# EAGLE design PwrGenBrd_v3 (EAGLE 7.6.0)
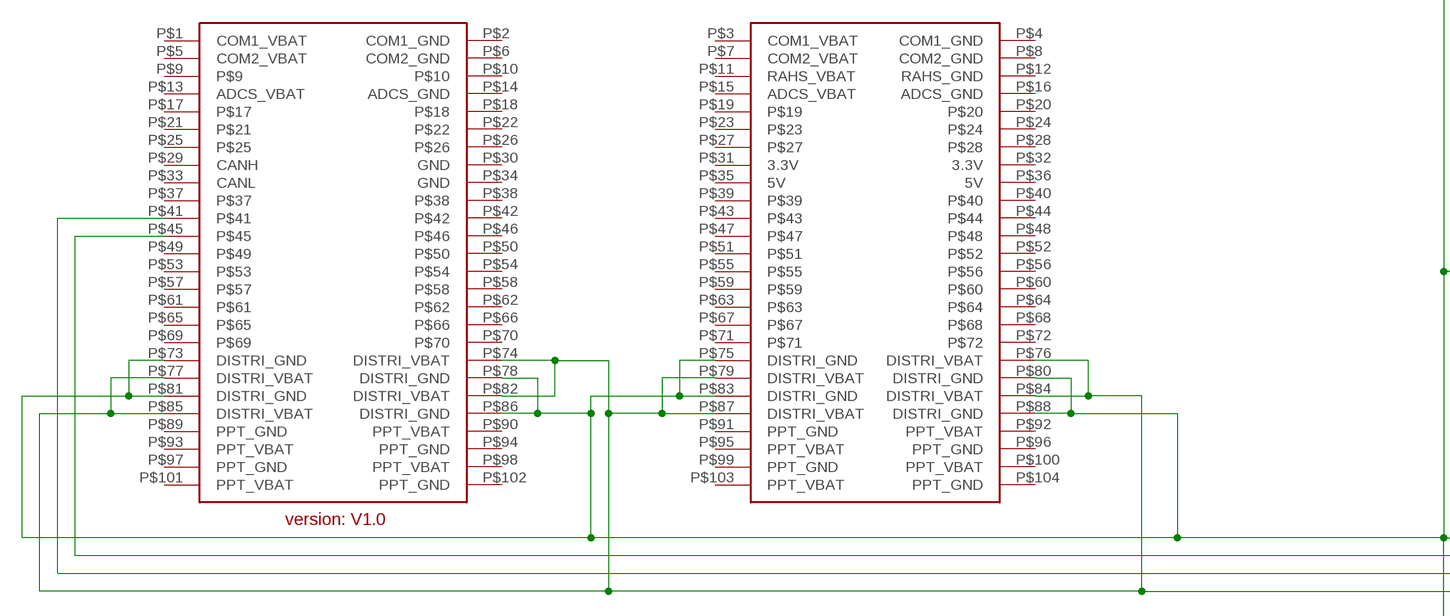
[diagram p0: schematic, sheet 1, part 1 of 2]
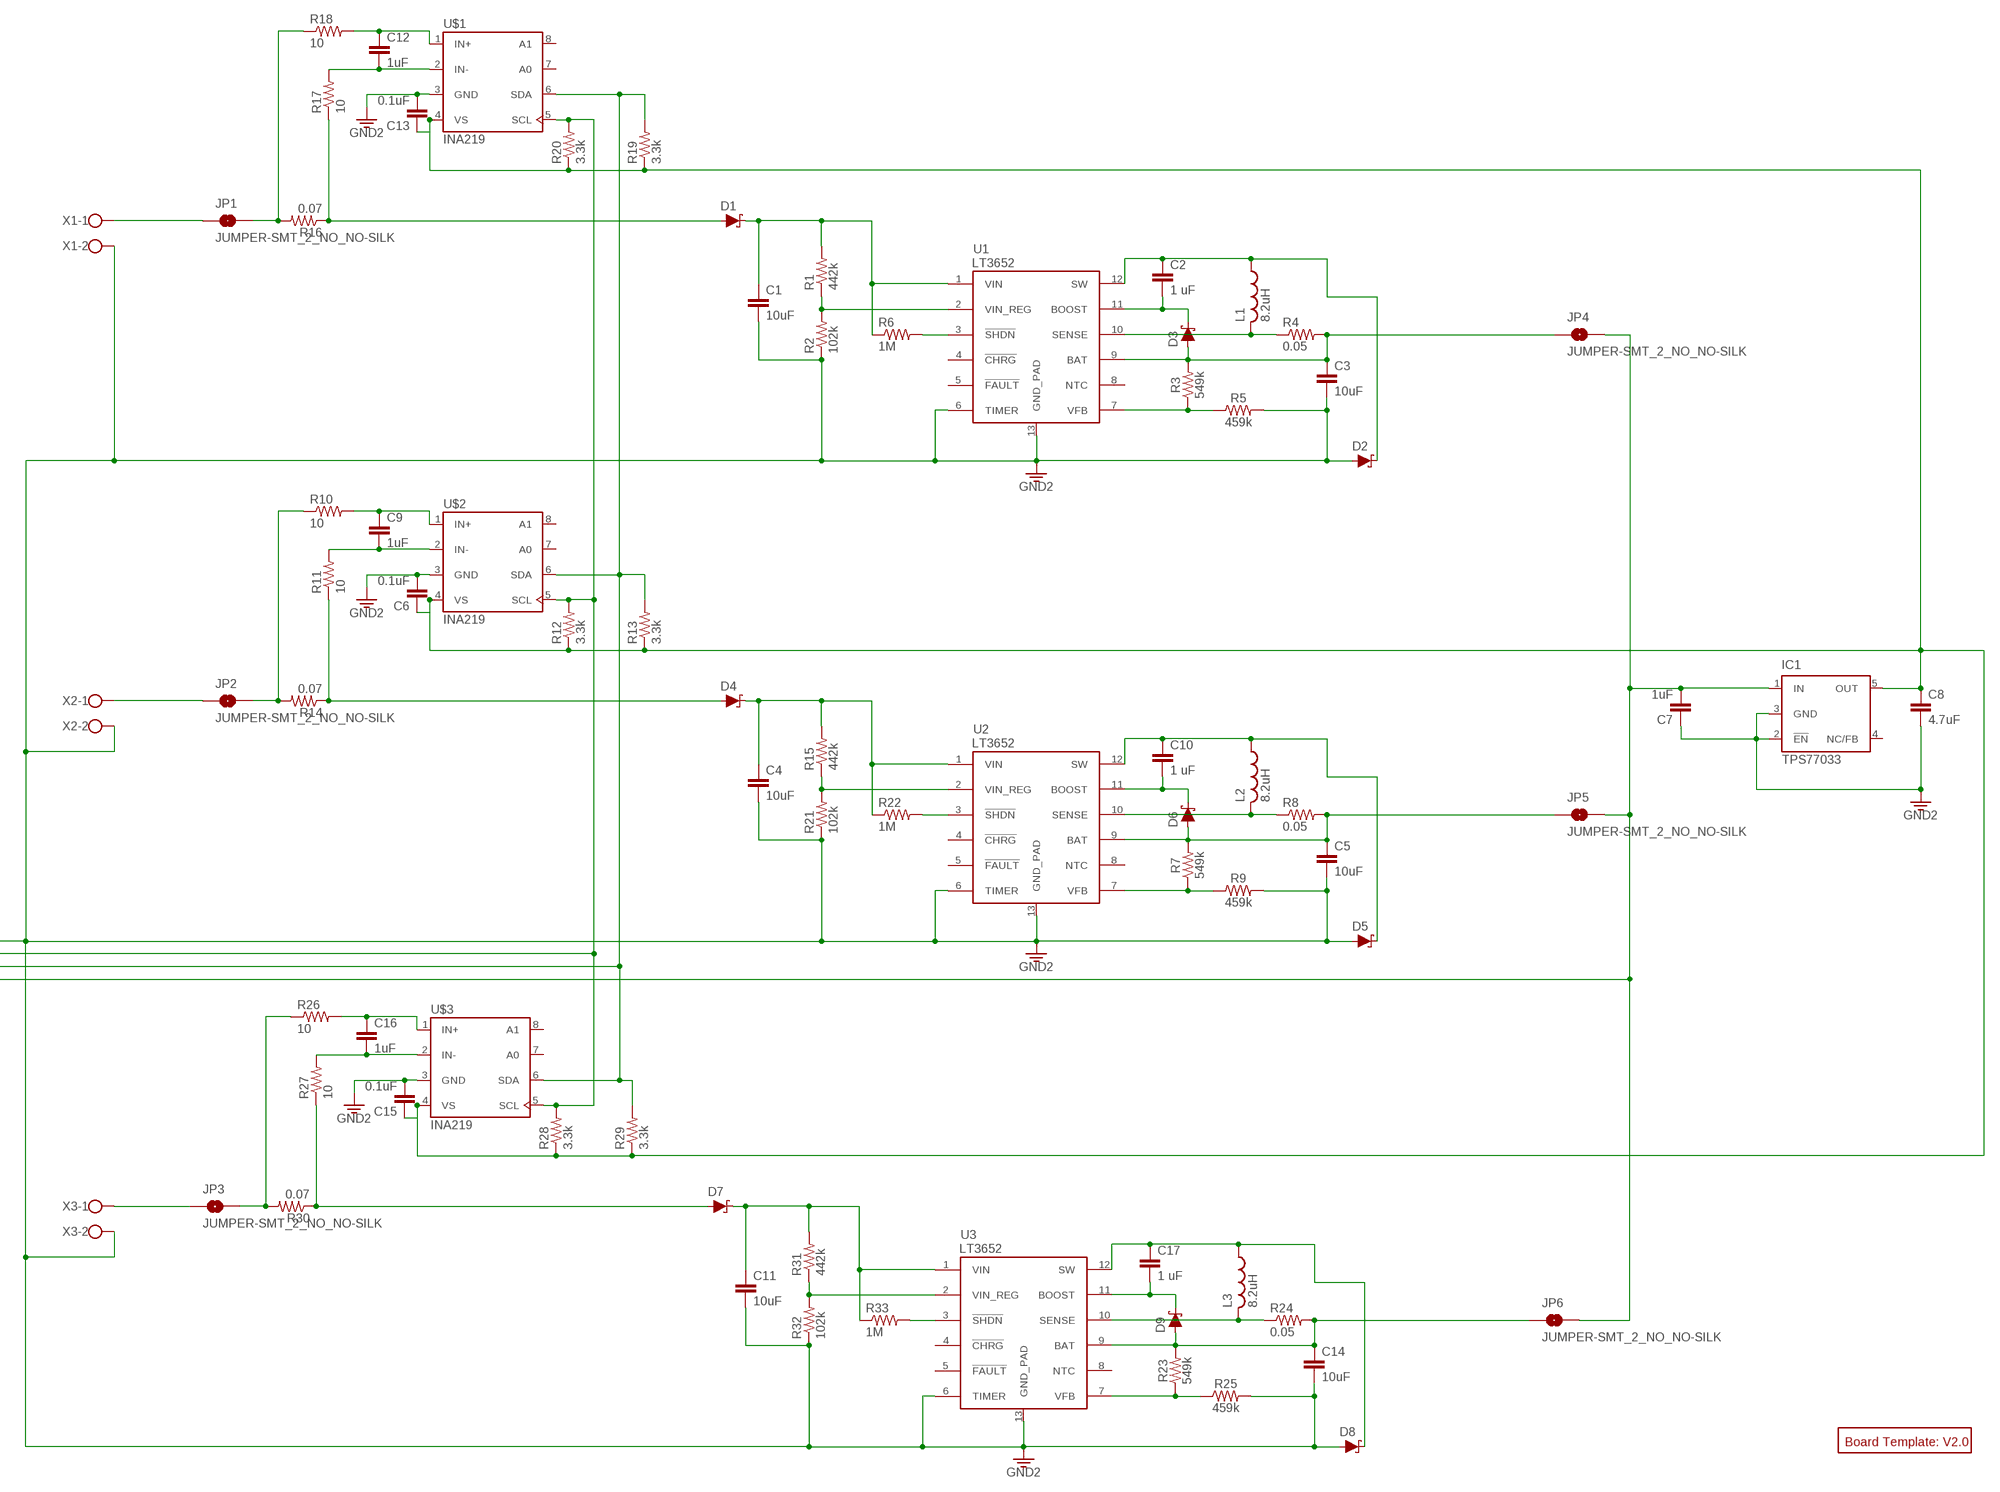
[diagram p1: schematic, sheet 1, part 2 of 2]

## Parts
C1  10uF  10UF-1210-50V-20%  [1210]
C2  1 uF  C-EUC0805  [C0805]
C3  10uF  10UF-1210-50V-20%  [1210]
C4  10uF  10UF-1210-50V-20%  [1210]
C5  10uF  10UF-1210-50V-20%  [1210]
C6  0.1uF  C-EUC0201  [C0201]
C7  1uF  C-EUC1210  [C1210]
C8  4.7uF  4.7UF0603  [0603]
C9  1uF  C-EUC1210  [C1210]
C10  1 uF  C-EUC0805  [C0805]
C11  10uF  10UF-1210-50V-20%  [1210]
C12  1uF  C-EUC1210  [C1210]
C13  0.1uF  C-EUC0201  [C0201]
C14  10uF  10UF-1210-50V-20%  [1210]
C15  0.1uF  C-EUC0201  [C0201]
C16  1uF  C-EUC1210  [C1210]
C17  1 uF  C-EUC0805  [C0805]
D1  DIODE-SCHOTTKY-B340A  [SMA-DIODE]
D2  DIODE-SCHOTTKY-B340A  [SMA-DIODE]
D3  DIODE-SCHOTTKY-ZLLS500  [SOT23-3]
D4  DIODE-SCHOTTKY-B340A  [SMA-DIODE]
D5  DIODE-SCHOTTKY-B340A  [SMA-DIODE]
D6  DIODE-SCHOTTKY-ZLLS500  [SOT23-3]
D7  DIODE-SCHOTTKY-B340A  [SMA-DIODE]
D8  DIODE-SCHOTTKY-B340A  [SMA-DIODE]
D9  DIODE-SCHOTTKY-ZLLS500  [SOT23-3]
IC1  TPS77033  [SOT23-DBV]
JP1  JUMPER-SMT_2_NO_NO-SILK  [SMT-JUMPER_2_NO_NO-SILK]
JP2  JUMPER-SMT_2_NO_NO-SILK  [SMT-JUMPER_2_NO_NO-SILK]
JP3  JUMPER-SMT_2_NO_NO-SILK  [SMT-JUMPER_2_NO_NO-SILK]
JP4  JUMPER-SMT_2_NO_NO-SILK  [SMT-JUMPER_2_NO_NO-SILK]
JP5  JUMPER-SMT_2_NO_NO-SILK  [SMT-JUMPER_2_NO_NO-SILK]
JP6  JUMPER-SMT_2_NO_NO-SILK  [SMT-JUMPER_2_NO_NO-SILK]
L1  8.2uH  L-USL1812  [L1812]
L2  8.2uH  L-USL1812  [L1812]
L3  8.2uH  L-USL1812  [L1812]
R1  442k  R-US_R0402  [R0402]
R2  102k  R-US_R0402  [R0402]
R3  549k  RESISTOR0805  [0805]
R4  0.05  R-US_R2512  [R2512]
R5  459k  RESISTOR1206  [1206]
R6  1M  R-US_R0402  [R0402]
R7  549k  RESISTOR0805  [0805]
R8  0.05  R-US_R2512  [R2512]
R9  459k  RESISTOR1206  [1206]
R10  10  R-US_R0402  [R0402]
R11  10  R-US_R0402  [R0402]
R12  3.3k  R-US_R0603  [R0603]
R13  3.3k  R-US_R0603  [R0603]
R14  0.07  R-US_R2512  [R2512]
R15  442k  R-US_R0402  [R0402]
R16  0.07  R-US_R2512  [R2512]
R17  10  R-US_R0402  [R0402]
R18  10  R-US_R0402  [R0402]
R19  3.3k  R-US_R0603  [R0603]
R20  3.3k  R-US_R0603  [R0603]
R21  102k  R-US_R0402  [R0402]
R22  1M  R-US_R0402  [R0402]
R23  549k  RESISTOR0805  [0805]
R24  0.05  R-US_R2512  [R2512]
R25  459k  RESISTOR1206  [1206]
R26  10  R-US_R0402  [R0402]
R27  10  R-US_R0402  [R0402]
R28  3.3k  R-US_R0603  [R0603]
R29  3.3k  R-US_R0603  [R0603]
R30  0.07  R-US_R2512  [R2512]
R31  442k  R-US_R0402  [R0402]
R32  102k  R-US_R0402  [R0402]
R33  1M  R-US_R0402  [R0402]
U1  LT3652  [MSOP-12_GND]
U2  LT3652  [MSOP-12_GND]
U3  LT3652  [MSOP-12_GND]
U$1  INA219  [SO08]
U$2  INA219  [SO08]
U$3  INA219  [SO08]
U$4  2X26_CONNECTOR  [4X26_CONNECTOR_(V1.0)]
U$5  BOARD_TEMPLATE  [BOARD_TEMPLATE_(V2.0)]
X1  W237-102  [W237-102]
X2  W237-102  [W237-102]
X3  W237-102  [W237-102]

## Nets
BATT: C3.1 D3.1(A) JP4.1 R3.2 R4.2 U1.9(BAT)
BATT1: C5.1 D6.1(A) JP5.1 R7.2 R8.2 U2.9(BAT)
BATT2: C14.1 D9.1(A) JP6.1 R23.2 R24.2 U3.9(BAT)
BOOST: C2.2 D3.3(C) U1.11(BOOST)
BOOST1: C10.2 D6.3(C) U2.11(BOOST)
BOOST2: C17.2 D9.3(C) U3.11(BOOST)
GND: C1.2 C3.2 C4.2 C5.2 C6.2 C11.2 C13.2 C14.2 C15.2 D2.A D5.A D8.A R2.1 R5.2 R9.2 R21.1 R25.2 R32.1 U1.6(TIMER) U1.13(GND_PAD) U2.6(TIMER) U2.13(GND_PAD) U3.6(TIMER) U3.13(GND_PAD) U$1.3(GND) U$2.3(GND) U$3.3(GND) U$4.P$73(DISTRI_GND) U$4.P$75(DISTRI_GND) U$4.P$78(DISTRI_GND) U$4.P$80(DISTRI_GND) U$4.P$81(DISTRI_GND) U$4.P$83(DISTRI_GND) U$4.P$86(DISTRI_GND) U$4.P$88(DISTRI_GND) X1.2 X2.2 X3.2 ; supply symbol labelled GND2
GND4: C7.1 C8.2 IC1.2(!EN) IC1.3(GND) ; supply symbol labelled GND2
IN+: C12.1 R18.2 U$1.1(IN+)
IN+1: C9.1 R10.2 U$2.1(IN+)
IN+2: C16.1 R26.2 U$3.1(IN+)
IN++: JP1.2 R16.2 R18.1
IN++1: JP2.2 R10.1 R14.2
IN++2: JP3.2 R26.1 R30.2
IN-: C12.2 R17.2 U$1.2(IN-)
IN-1: C9.2 R11.2 U$2.2(IN-)
IN-2: C16.2 R27.2 U$3.2(IN-)
IN--: D1.A R16.1 R17.1
IN--1: D4.A R11.1 R14.1
IN--2: D7.A R27.1 R30.1
N$2: R6.2 U1.3(!SHDN)
PNL1: JP1.1 X1.1
PNL2: JP2.1 X2.1
PNL3: JP3.1 X3.1
SCL: R12.2 R20.2 R28.2 U$1.5(SCL) U$2.5(SCL) U$3.5(SCL) U$4.P$45
SDA: R13.2 R19.2 R29.2 U$1.6(SDA) U$2.6(SDA) U$3.6(SDA) U$4.P$41
SENSE: L1.2 R4.1 U1.10(SENSE)
SENSE1: L2.2 R8.1 U2.10(SENSE)
SENSE2: L3.2 R24.1 U3.10(SENSE)
SHDN2: R22.2 U2.3(!SHDN)
SHDN3: R33.2 U3.3(!SHDN)
SW: C2.1 D2.C L1.1 U1.12(SW)
SW1: C10.1 D5.C L2.1 U2.12(SW)
SW2: C17.1 D8.C L3.1 U3.12(SW)
VBATT: C7.2 IC1.1(IN) JP4.2 JP5.2 JP6.2 U$4.P$74(DISTRI_VBAT) U$4.P$76(DISTRI_VBAT) U$4.P$77(DISTRI_VBAT) U$4.P$79(DISTRI_VBAT) U$4.P$82(DISTRI_VBAT) U$4.P$84(DISTRI_VBAT) U$4.P$85(DISTRI_VBAT) U$4.P$87(DISTRI_VBAT)
VFB: R3.1 R5.1 U1.7(VFB)
VFB1: R7.1 R9.1 U2.7(VFB)
VFB2: R23.1 R25.1 U3.7(VFB)
VIN: C1.1 D1.C R1.2 R6.1 U1.1(VIN)
VIN1: C4.1 D4.C R15.2 R22.1 U2.1(VIN)
VIN2: C11.1 D7.C R31.2 R33.1 U3.1(VIN)
VIN_REG: R1.1 R2.2 U1.2(VIN_REG)
VIN_REG1: R15.1 R21.2 U2.2(VIN_REG)
VIN_REG2: R31.1 R32.2 U3.2(VIN_REG)
VS: C6.1 C8.1 C13.1 C15.1 IC1.5(OUT) R12.1 R13.1 R19.1 R20.1 R28.1 R29.1 U$1.4(VS) U$2.4(VS) U$3.4(VS)
Unconnected: IC1.4(NC/FB) U1.4(!CHRG) U1.5(!FAULT) U1.8(NTC) U2.4(!CHRG) U2.5(!FAULT) U2.8(NTC) U3.4(!CHRG) U3.5(!FAULT) U3.8(NTC) U$1.7(A0) U$1.8(A1) U$2.7(A0) U$2.8(A1) U$3.7(A0) U$3.8(A1) U$4.P$1(COM1_VBAT) U$4.P$2(COM1_GND) U$4.P$3(COM1_VBAT) U$4.P$4(COM1_GND) U$4.P$5(COM2_VBAT) U$4.P$6(COM2_GND) U$4.P$7(COM2_VBAT) U$4.P$8(COM2_GND) U$4.P$9 U$4.P$10 U$4.P$11(RAHS_VBAT) U$4.P$12(RAHS_GND) U$4.P$13(ADCS_VBAT) U$4.P$14(ADCS_GND) U$4.P$15(ADCS_VBAT) U$4.P$16(ADCS_GND) U$4.P$17 U$4.P$18 U$4.P$19 U$4.P$20 U$4.P$21 U$4.P$22 U$4.P$23 U$4.P$24 U$4.P$25 U$4.P$26 U$4.P$27 U$4.P$28 U$4.P$29(CANH) U$4.P$30(GND) U$4.P$31(3.3V) U$4.P$32(3.3V) U$4.P$33(CANL) U$4.P$34(GND) U$4.P$35(5V) U$4.P$36(5V) U$4.P$37 U$4.P$38 U$4.P$39 U$4.P$40 U$4.P$42 U$4.P$43 U$4.P$44 U$4.P$46 U$4.P$47 U$4.P$48 U$4.P$49 U$4.P$50 U$4.P$51 U$4.P$52 U$4.P$53 U$4.P$54 U$4.P$55 U$4.P$56 U$4.P$57 U$4.P$58 U$4.P$59 U$4.P$60 U$4.P$61 U$4.P$62 U$4.P$63 U$4.P$64 U$4.P$65 U$4.P$66 U$4.P$67 U$4.P$68 U$4.P$69 U$4.P$70 U$4.P$71 U$4.P$72 U$4.P$89(PPT_GND) U$4.P$90(PPT_VBAT) U$4.P$91(PPT_GND) U$4.P$92(PPT_VBAT) U$4.P$93(PPT_VBAT) U$4.P$94(PPT_GND) U$4.P$95(PPT_VBAT) U$4.P$96(PPT_GND) U$4.P$97(PPT_GND) U$4.P$98(PPT_VBAT) U$4.P$99(PPT_GND) U$4.P$100(PPT_VBAT) U$4.P$101(PPT_VBAT) U$4.P$102(PPT_GND) U$4.P$103(PPT_VBAT) U$4.P$104(PPT_GND)

## Library data of the parts
C1 C3-C5 C11 C14 = SparkFun-Capacitors:10UF: 10.0µF ceramic capacitors A capacitor is a passive two-terminal electrical component used to store electrical energy temporarily in an electric field.; PROD_ID: CAP-09824
C2 C6 C7 C9 C10 C12 C13 C15-C17 = rcl:C-EU: CAPACITOR, European symbol
C8 = SparkFun-Capacitors:4.7UF: 4.7µF ceramic capacitors A capacitor is a passive two-terminal electrical component used to store electrical energy temporarily in an electric field.; PROD_ID: CAP-08280
D1 D2 D4 D5 D7 D8 = SparkFun-DiscreteSemi:DIODE-SCHOTTKY: Schottky diode A Schottky diode is a semiconductor diode which has a low forward voltage drop and a very fast switching action.; PROD_ID: DIO-09886; VALUE: 3A/40V/500mV
D3 D6 D9 = SparkFun-DiscreteSemi:DIODE-SCHOTTKY: Schottky diode A Schottky diode is a semiconductor diode which has a low forward voltage drop and a very fast switching action.; PROD_ID: DIO-08411; VALUE: 700mA/40V/533mV
IC1 = texas:TPS770*: ULTRALOW-POWER 50-mA LOW-DROPOUT LINEAR REGULATORS 50-mA Low-Dropout Regulator Source: http://focus.ti.com/lit/ds/symlink/tps77001.pdf; MF: TEXAS INSTRUMENTS; MPN: TPS77033DBVT; OC_FARNELL: 8461570; OC_NEWARK: 77C1187
JP1-JP6 = SparkFun-Jumpers:JUMPER-SMT_2_NO: Normally open jumper This jumper has two pads in close proximity to each other. Apply solder to close the connection. Round pads are easier to solder for beginners, but are a lot larger. SparkFun Product that uses the round pads: SparkFun EL Sequencer <https://www.sparkfun.com/products/12781>
L1-L3 = rcl:L-US: INDUCTOR, American symbol
R1 R2 R6 R15 R21 R22 R31-R33 = rcl:R-US_: RESISTOR, American symbol
R3 R5 R7 R9 R23 R25 = SparkFun-Resistors:RESISTOR: Generic Resistor Package
R4 R8 R10-R14 R16-R20 R24 R26-R30 = resistor:R-US_: RESISTOR, American symbol
U1-U3 = SparkFun-IC-Power:LT3652: LT3652 MPPT Solar Charge Controller(IC-11822) 5V-32V smart charger for batteries up to 14.4V
U$1-U$3 = User-Submitted:INA219
U$4 = CubeSat(V1.0):2X26_CONNECTOR
U$5 = CubeSat(V1.0):BOARD_TEMPLATE
X1-X3 = con-wago-500:W237-102: WAGO SCREW CLAMP; MPN: 237-102; OC_FARNELL: unknown; OC_NEWARK: 70K9898

## Board
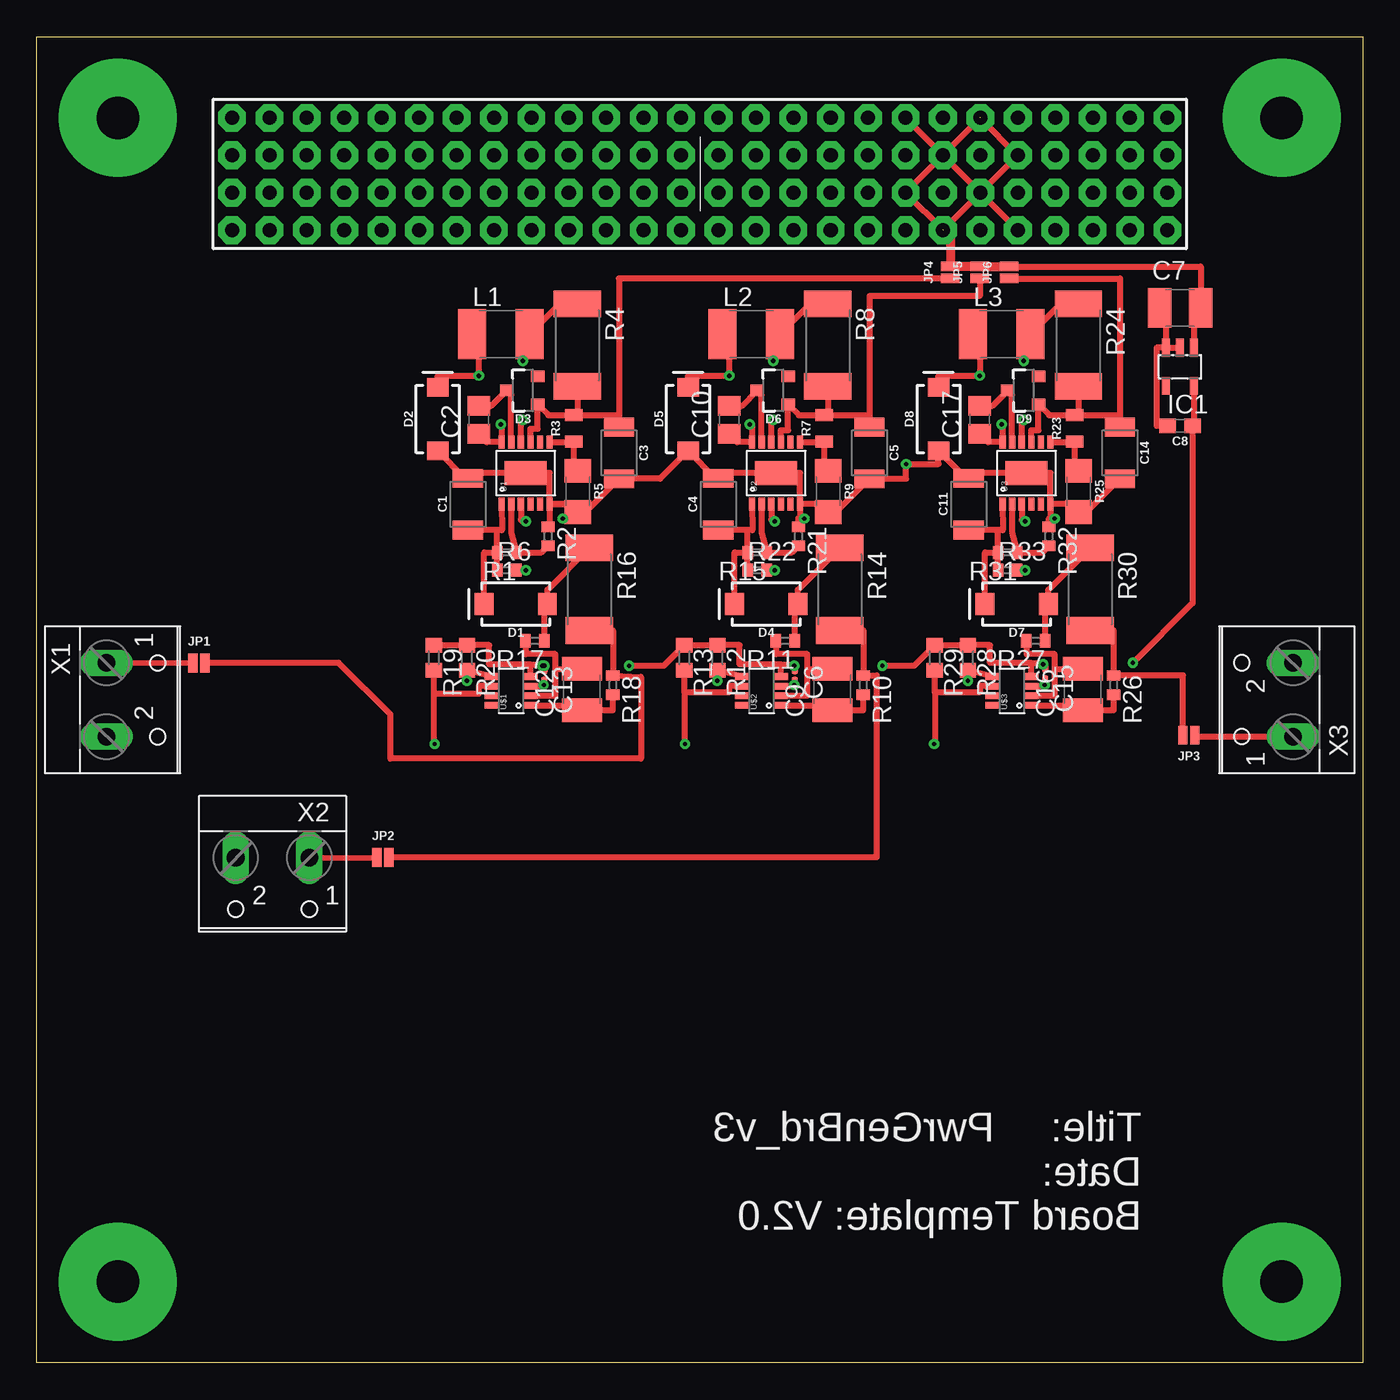
[diagram p2: board, top side]
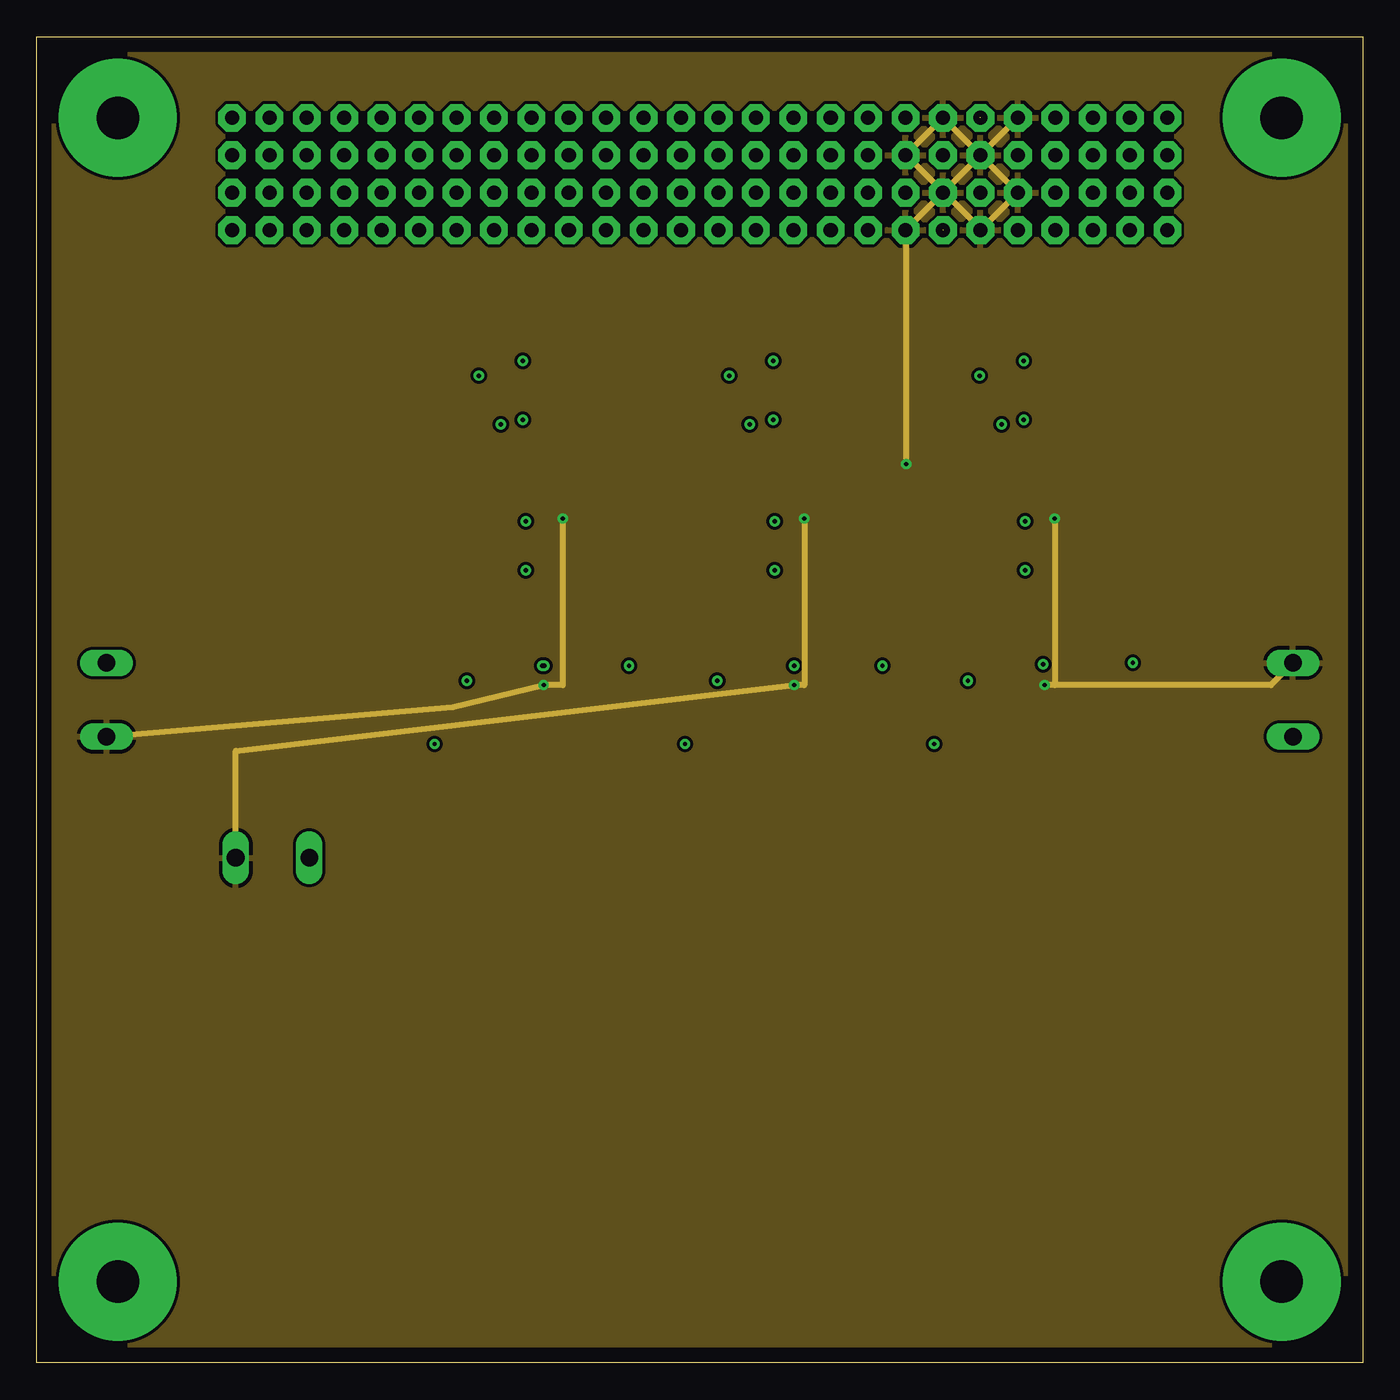
[diagram p3: board, inner layer GND]
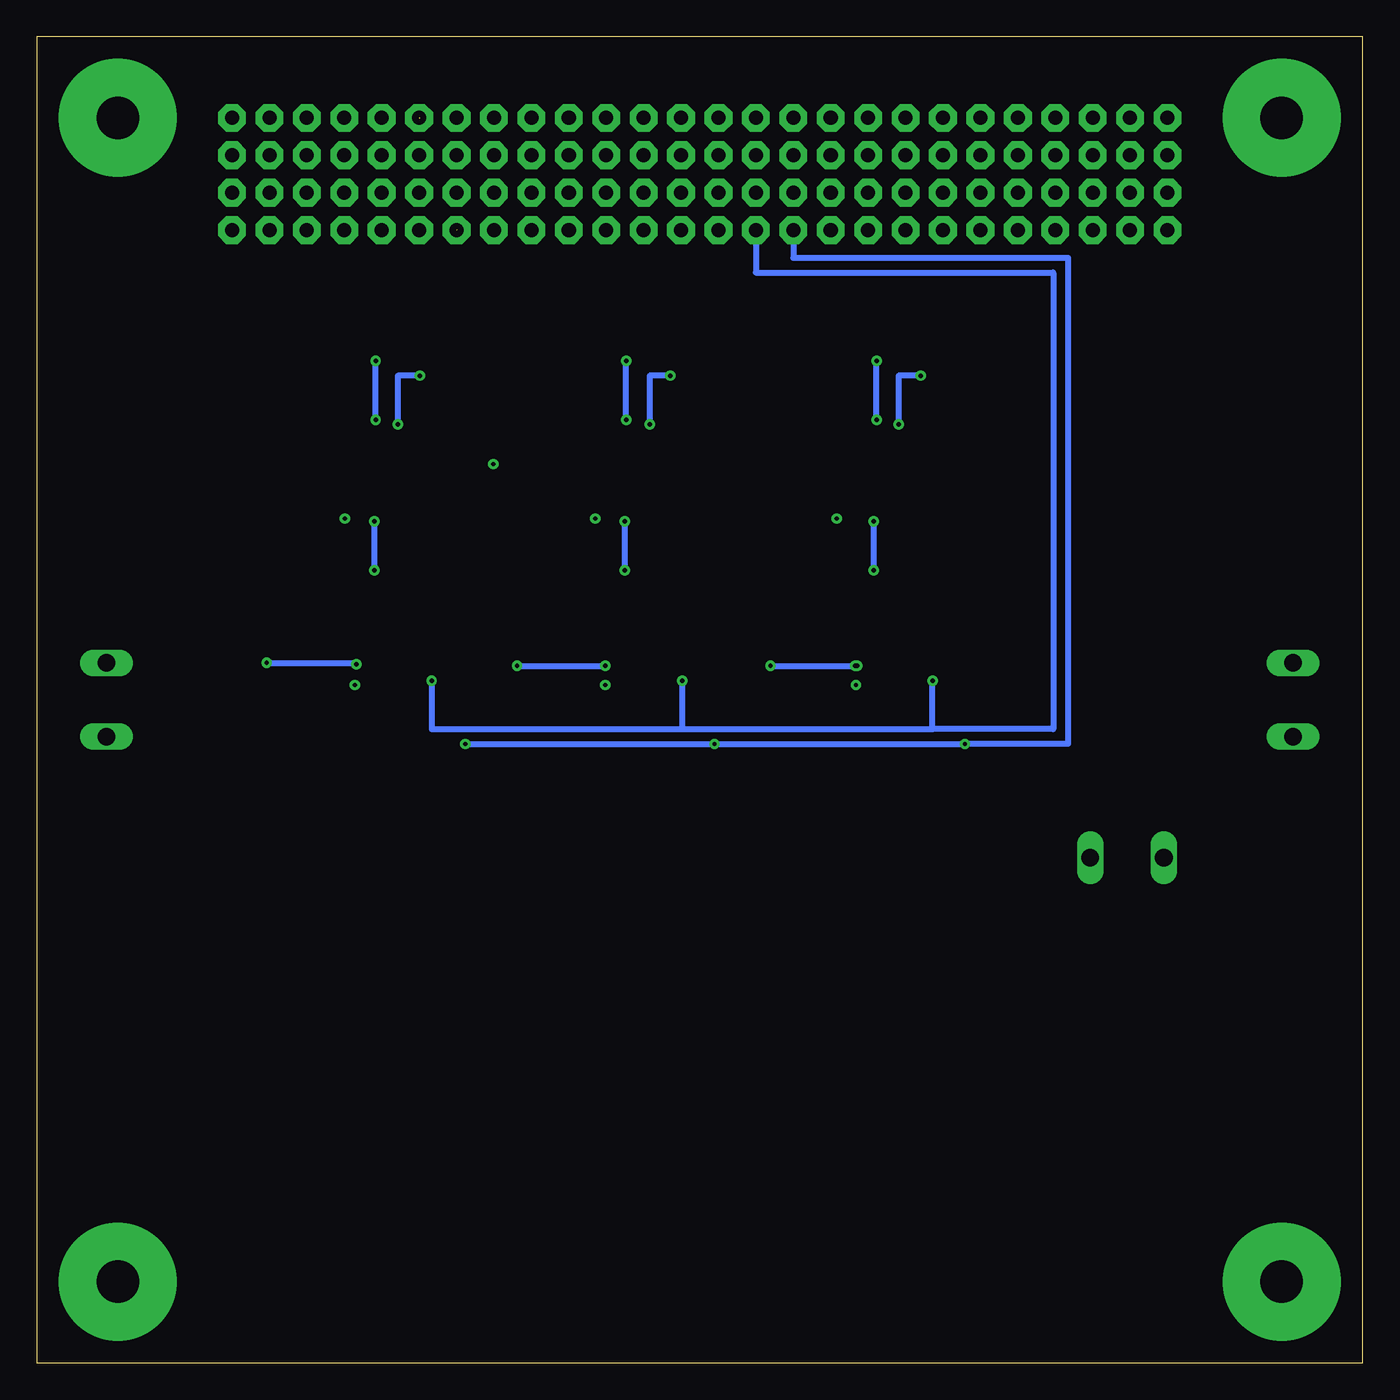
[diagram p4: board, bottom side, seen from below]

Size 90 x 90 mm. Coordinates in mm from the lower left corner, seen from the top.
Copper layers (1*2*3*16): Top 0.035mm / dielectric 1.5mm / GND 0.035mm / dielectric 0.15mm / TBD 0.035mm / dielectric 0.2mm / Bottom 0.035mm
Design rules "default *": minimum track width 10mil, minimum drill 24mil, track to track 8mil, track to pad 8mil, pad to pad 8mil, via to via 8mil, smd to smd 8mil, copper to edge 40mil, drill to drill 8mil, minimum pad ring 10mil, minimum via ring 8mil, stop-mask expansion 4mil, vias tented up to drill 0mil, thermal gap 10mil

### Footprints (pad centres in the part's own frame; a part is rotated, then mirrored left to right if it is on the bottom)
1210 = smd 1.27 x 2.06: 1 -1.755,0; 2 1.755,0
C0805 = smd 1.3 x 1.5: 1 -0.95,0; 2 0.95,0
C0201 = smd 0.25 x 0.35: 1 -0.25,0; 2 0.25,0
C1210 = smd 1.6 x 2.7: 1 -1.4,0; 2 1.4,0
0603 = smd 1.1 x 1: 1 -0.85,0; 2 0.85,0
SMA-DIODE = smd 1.27 x 1.47: A -2.15,0; C 2.15,0
SOT23-3 = smd 0.8 x 0.9: 1 -0.95,-1; 2 0.95,-1; 3 0,1.1
SOT23-DBV = smd 0.55 x 1.2: 1 -0.95,-1.3; 2 0,-1.3; 3 0.95,-1.3; 4 0.95,1.3; 5 -0.95,1.3
SMT-JUMPER_2_NO_NO-SILK = smd 0.635 x 1.27: 1 -0.406,0; 2 0.406,0
L1812 = smd 1.9 x 3.4: 1 -1.95,0; 2 1.95,0
R0402 = smd 0.7 x 0.9: 1 -0.65,0; 2 0.65,0
0805 = smd 0.8 x 1.2: 1 -0.9,0; 2 0.9,0
R2512 = smd 1.8 x 3.2: 1 -2.8,0; 2 2.8,0
1206 = smd 1.6 x 1.8: 1 -1.4,0; 2 1.4,0
R0603 = smd 1 x 1.1: 1 -0.85,0; 2 0.85,0
MSOP-12_GND = smd 0.889 x 0.42: 1 -2.1,1.625; 2 -2.1,0.975; 3 -2.1,0.325; 4 -2.1,-0.325; 5 -2.1,-0.975; 6 -2.1,-1.625; 7 2.1,-1.625; 8 2.1,-0.975; 9 2.1,-0.325; 10 2.1,0.325; 11 2.1,0.975; 12 2.1,1.625 | smd 1.651 x 2.845: 13 0,0
SO08 = smd 0.45 x 1: 1 -0.975,-1.3; 2 -0.325,-1.3; 3 0.325,-1.3; 4 0.975,-1.3; 5 0.975,1.3; 6 0.325,1.3; 7 -0.325,1.3; 8 -0.975,1.3
4X26_CONNECTOR_(V1.0) = drill 0.953 pad 1.88 octagon: P$1 -31.75,31.88; P$2 -31.75,34.42; P$3 -31.75,36.96; P$4 -31.75,39.5; P$5 -29.21,31.88; P$6 -29.21,34.42; P$7 -29.21,36.96; P$8 -29.21,39.5; P$9 -26.67,31.88; P$10 -26.67,34.42; P$11 -26.67,36.96; P$12 -26.67,39.5; P$13 -24.13,31.88; P$14 -24.13,34.42; P$15 -24.13,36.96; P$16 -24.13,39.5; P$17 -21.59,31.88; P$18 -21.59,34.42; P$19 -21.59,36.96; P$20 -21.59,39.5; P$21 -19.05,31.88; P$22 -19.05,34.42; P$23 -19.05,36.96; P$24 -19.05,39.5; P$25 -16.51,31.88; P$26 -16.51,34.42; P$27 -16.51,36.96; P$28 -16.51,39.5; P$29 -13.97,31.88; P$30 -13.97,34.42; P$31 -13.97,36.96; P$32 -13.97,39.5; P$33 -11.43,31.88; P$34 -11.43,34.42; P$35 -11.43,36.96; P$36 -11.43,39.5; P$37 -8.89,31.88; P$38 -8.89,34.42; P$39 -8.89,36.96; P$40 -8.89,39.5; P$41 -6.35,31.88; P$42 -6.35,34.42; P$43 -6.35,36.96; P$44 -6.35,39.5; P$45 -3.81,31.88; P$46 -3.81,34.42; P$47 -3.81,36.96; P$48 -3.81,39.5; P$49 -1.27,31.88; P$50 -1.27,34.42; P$51 -1.27,36.96; P$52 -1.27,39.5; P$53 1.27,31.88; P$54 1.27,34.42; P$55 1.27,36.96; P$56 1.27,39.5; P$57 3.81,31.88; P$58 3.81,34.42; P$59 3.81,36.96; P$60 3.81,39.5; P$61 6.35,31.88; P$62 6.35,34.42; P$63 6.35,36.96; P$64 6.35,39.5; P$65 8.89,31.88; P$66 8.89,34.42; P$67 8.89,36.96; P$68 8.89,39.5; P$69 11.43,31.88; P$70 11.43,34.42; P$71 11.43,36.96; P$72 11.43,39.5; P$73 13.97,31.88; P$74 13.97,34.42; P$75 13.97,36.96; P$76 13.97,39.5; P$77 16.51,31.88; P$78 16.51,34.42; P$79 16.51,36.96; P$80 16.51,39.5; P$81 19.05,31.88; P$82 19.05,34.42; P$83 19.05,36.96; P$84 19.05,39.5; P$85 21.59,31.88; P$86 21.59,34.42; P$87 21.59,36.96; P$88 21.59,39.5; P$89 24.13,31.88; P$90 24.13,34.42; P$91 24.13,36.96; P$92 24.13,39.5; P$93 26.67,31.88; P$94 26.67,34.42; P$95 26.67,36.96; P$96 26.67,39.5; P$97 29.21,31.88; P$98 29.21,34.42; P$99 29.21,36.96; P$100 29.21,39.5; P$101 31.75,31.88; P$102 31.75,34.42; P$103 31.75,36.96; P$104 31.75,39.5
BOARD_TEMPLATE_(V2.0) = drill 2.9 pad 8: P$1 -39.5,39.5; P$2 -39.5,-39.5; P$3 39.5,-39.5; P$4 39.5,39.5
W237-102 = drill 1.194 long: 1 -2.5,-1.27; 2 2.5,-1.27

### Placement (x,y rotation side)
C1  29.26,58.27 90 top
C2  30,64 90 top
C3  39.52,61.76 270 top
C4  46.26,58.27 90 top
C5  56.52,61.76 270 top
C6  51.45,46.65 270 top
C7  77.6,71.6 0 top
C8  77.6,63.6 180 top
C9  54,45.7 90 top
C10  47,64 90 top
C11  63.26,58.27 90 top
C12  37,45.7 90 top
C13  34.45,46.65 270 top
C14  73.52,61.76 270 top
C15  68.45,46.75 270 top
C16  71,45.7 90 top
C17  64,64 90 top
D1  32.51,51.5 180 top
D2  27.21,64.05 90 top
D3  33,66 90 top
D4  49.51,51.5 180 top
D5  44.21,64.05 90 top
D6  50,66 90 top
D7  66.51,51.5 180 top
D8  61.21,64.05 90 top
D9  67,66 90 top
IC1  77.6,67.6 180 top
JP1  11,47.5 0 top
JP2  23.5,34.3 0 top
JP3  78.2,42.6 180 top
JP4  62,74 90 top
JP5  64,74 90 top
JP6  66,74 90 top
L1  31.49,69.81 0 top
L2  48.49,69.81 0 top
L3  65.49,69.81 0 top
R1  31.9,55 180 top
R2  34.7,56.1 270 top
R3  36.44,63.42 90 top
R4  36.69,69.08 270 top
R5  36.72,59.14 270 top
R6  31.9,53.8 0 top
R7  53.44,63.42 90 top
R8  53.69,69.08 270 top
R9  53.72,59.14 270 top
R10  56.1,46 270 top
R11  50.8,49 180 top
R12  46.2,47.85 270 top
R13  43.95,47.85 270 top
R14  54.5,52.5 270 top
R15  48.9,55 180 top
R16  37.5,52.5 270 top
R17  33.8,49 180 top
R18  39.1,46 270 top
R19  26.95,47.85 270 top
R20  29.2,47.85 270 top
R21  51.7,56.1 270 top
R22  48.9,53.8 0 top
R23  70.44,63.42 90 top
R24  70.69,69.08 270 top
R25  70.72,59.14 270 top
R26  73.1,46 270 top
R27  67.8,49 180 top
R28  63.2,47.85 270 top
R29  60.95,47.85 270 top
R30  71.5,52.5 270 top
R31  65.9,55 180 top
R32  68.7,56.1 270 top
R33  65.9,53.8 0 top
U1  33.18,60.39 90 top
U2  50.18,60.39 90 top
U3  67.18,60.39 90 top
U$1  32.2,45.6 90 top
U$2  49.2,45.6 90 top
U$3  66.2,45.6 90 top
U$4  45,45 0 top
U$5  45,45 0 top
X1  6,45 270 top
X2  16,33 180 top
X3  84,45 90 top

### Tracks (layer width: path | path; a pad name or v marks a point on that pad's centre or on a via)
BATT
  Top 0.406: R4.2 36.69,64.57 R3.2 | R3.2 34.73,64.32 D3.1 34,63.4 33.51,63.4 U1.9 | R3.2 39.52,64.32 C3.1 39.52,73.59 JP4.1
BATT1
  Top 0.406: R8.2 53.69,64.57 R7.2 | R7.2 51.73,64.32 D6.1 51,63.3 50.51,63.3 U2.9 | R7.2 56.52,64.32 C5.1 56.52,72.4 64,72.4 JP5.1
BATT2
  Top 0.406: R24.2 70.69,64.57 R23.2 | R23.2 68.73,64.32 D9.1 68,63.3 67.5,63.3 U3.9 | R23.2 73.52,64.32 C14.1 73.52,73.59 JP6.1
BOOST
  Top 0.406: U1.11 32.2,65.69 D3.3 30.85,64.95 C2.2
BOOST1
  Top 0.406: U2.11 49.2,65.69 D6.3 47.85,64.95 C10.2
BOOST2
  Top 0.406: U3.11 66.2,65.69 D9.3 64.85,64.95 C17.2
GND  (via drill 0.3, 0.6)
  Top 0.406: D2.A 29.09,60.02 C1.2 29.62,60.39 U1.13 34.8,60.39 U1.6 | U1.6 34.8,56.74 R2.1 | U1.6 36.17,58.29 R5.2 37.26,57.74 C3.2 42.31,60.01 D5.A 46.09,60.02 C4.2 46.62,60.39 U2.13 51.8,60.39 U2.6 | U2.6 51.8,56.74 R21.1 51.7,57.3 v52.1,57.3 | U2.6 53.17,58.29 R9.2 54.26,57.74 C5.2 59,60.01 v59,61 61.21,61 D8.A 63.09,60.02 C11.2 63.62,60.39 U3.13 68.81,60.39 U3.6 | U3.6 68.81,56.74 R32.1 68.7,57.3 v69.1,57.3 | U3.6 70.17,58.29 R25.2 71.25,57.74 C14.2 | U$3.3 68.4,45.92 v68.4,46 68.45,46 C15.2 | U$2.3 51.4,45.92 v51.4,46 51.45,46 C6.2 | U$1.3 34.4,45.92 v34.4,46 34.45,46 C13.2 | U1.6 36.8,58.3 36.8,57.3 v35.7,57.3
  GND 0.406: U$4.P$73 U$4.P$78 U$4.P$83 | U$4.P$81 U$4.P$86 U$4.P$83 | U$4.P$83 U$4.P$88 | U$4.P$75 U$4.P$80 U$4.P$83 | X3.2 83.77,46 v68.4,46 69.1,46 v69.1,57.3 | X2.2 13.5,41.53 v51.4,46 52.1,46 v52.1,57.3 | X1.2 28.23,44.5 v34.4,46 35.7,46 v35.7,57.3 | 64,77 59,82 | v59,76.88 v59,61
  Bottom 0.406: U$4.P$73 v59,76.88
  pour GND: 0,90 90,90 90,0 0,0 0,2
GND4
  Top 0.406: C7.1 76.65,71.6 IC1.3 | IC1.3 IC1.2 | IC1.3 76,68.9 76,63.6 C8.2
IN+
  Top 0.406: U$1.1 37.38,44.62 C12.1 39.1,44.3 R18.2
IN+1
  Top 0.406: U$2.1 54.38,44.62 C9.1 56.1,44.3 R10.2
IN+2
  Top 0.406: U$3.1 71.38,44.62 C16.1 73.1,44.3 R26.2
IN++
  Top 0.406: JP1.2 20.49,47.51 24,44 24,41 41,41 41,46.55 R18.1 39.1,49.7 R16.2
IN++1
  Top 0.406: R14.2 56.1,49.7 R10.1 57,46.65 57,34.31 JP2.2
IN++2
  Top 0.406: JP3.2 77.79,46.65 R26.1 73.1,49.7 R30.2
IN-
  Top 0.406: U$1.2 35.2,45.27 35.2,47.1 | 35.2,47.1 C12.2 | 35.2,47.1 35.2,48.1 33.2,48.1 33.2,49 R17.2
IN-1
  Top 0.406: U$2.2 52.3,45.27 52.3,47.1 | 52.3,47.1 C9.2 | 52.3,47.1 52.3,48.1 50.2,48.1 50.2,49 R11.2
IN-2
  Top 0.406: U$3.2 69.1,45.27 69.1,47.1 | 69.1,47.1 C16.2 | 69.1,47.1 69.1,48.1 67.2,48.1 67.2,49 R27.2
IN--
  Top 0.406: R17.1 34.45,51.5 D1.A 34.66,52.46 R16.1
IN--1
  Top 0.406: R11.1 51.45,51.5 D4.A 51.66,52.46 R14.1
IN--2
  Top 0.406: R27.1 68.45,51.5 D7.A 68.66,52.46 R30.1
N$2  (via drill 0.3)
  Top 0.406: U1.3 32.86,57.24 arc90 v33.2,57.1 | v33.2,53.8 R6.2
  Bottom 0.406: v33.2,57.1 v33.2,53.8
PNL1
  Top 0.406: JP1.1 10.63,47.46 X1.1
PNL2
  Top 0.406: X2.1 JP2.1
PNL3
  Top 0.406: JP3.1 78.61,42.5 X3.1
SCL  (via drill 0.3)
  Top 0.406: 63.2,46.58 R28.2 | 46.2,46.58 R12.2 | 29.2,46.58 R20.2 | U$1.5 R20.2 | v29.2,46.3 R20.2 | U$2.5 R12.2 | U$3.5 R28.2 | R12.2 v46.2,46.3 | R28.2 v63.2,46.3
  Bottom 0.406: U$4.P$45 41.19,74 21,74 21,43 29.2,43 | 29.2,43 v29.2,46.3 | v46.2,46.3 46.2,43 | 46.2,43 46,43 29.2,43 | v63.2,46.3 63.2,43 46.2,43
SDA  (via drill 0.3)
  Top 0.406: U$1.6 30,45.92 30,45.4 26.95,45.4 | 26.95,45.4 R19.2 | v27,42 26.95,42 26.95,45.4 | 60.95,45.5 60.95,42 v60.9,42 | 43.95,45.5 43.95,42 v44,42 | U$2.6 47,45.92 47,45.5 43.95,45.5 | 43.95,45.5 R13.2 | U$3.6 64,45.92 64,45.5 60.95,45.5 | 60.95,45.5 R29.2
  Bottom 0.406: U$4.P$41 38.65,75 20,75 20,42 v27,42 v44,42 v60.9,42
SENSE  (via drill 0.3)
  Top 0.406: 34.1,70.47 L1.2 | L1.2 35.51,71.88 R4.1 | U1.10 32.86,64 v33,64 | v33,68 33,69.81 L1.2
  Bottom 0.406: v33,64 v33,68
SENSE1  (via drill 0.3)
  Top 0.406: R8.1 52.51,71.88 L2.2 50,69.81 v50,68 | U2.10 49.86,64 v50,64
  Bottom 0.406: v50,64 v50,68
SENSE2  (via drill 0.3)
  Top 0.406: R24.1 69.51,71.88 L3.2 67,69.81 v67,68 | U3.10 66.86,64 v67,64
  Bottom 0.406: v67,64 v67,68
SHDN2  (via drill 0.3)
  Top 0.406: U2.3 49.86,57.24 arc90 v50.1,57.1 | v50.1,53.8 R22.2
  Bottom 0.406: v50.1,57.1 v50.1,53.8
SHDN3  (via drill 0.3)
  Top 0.406: U3.3 66.86,57.24 arc90 v67.1,57.1 | v67.1,53.8 R33.2
  Bottom 0.406: v67.1,57.1 v67.1,53.8
SW  (via drill 0.3)
  Top 0.406: C2.1 30.56,62.49 U1.12 31.55,63.7 v31.5,63.7 | L1.1 30,69.81 v30,67 27.21,67 D2.C
  Bottom 0.406: v30,67 31.5,67 v31.5,63.7
SW1  (via drill 0.3)
  Top 0.406: C10.1 47.56,62.49 U2.12 48.55,63.7 v48.4,63.7 | L2.1 47,69.81 v47,67 44.21,67 D5.C
  Bottom 0.406: v47,67 48.4,67 v48.4,63.7
SW2  (via drill 0.3)
  Top 0.406: C17.1 64.56,62.49 U3.12 65.56,63.7 v65.5,63.7 | L3.1 64,69.81 v64,67 61.21,67 D8.C
  Bottom 0.406: v64,67 65.5,67 v65.5,63.7
VBATT  (2 unrouted)
  Top 0.406: U$4.P$82 U$4.P$77 62,76.39 | U$4.P$74 U$4.P$79 | U$4.P$79 U$4.P$84 | U$4.P$87 U$4.P$82 | U$4.P$79 U$4.P$82 | U$4.P$85 U$4.P$82 | U$4.P$76 U$4.P$79 | IC1.1 78.55,71.6 C7.2 79,74.41 JP6.2 | 59,79.4 61.5,76.9 | 64,84.5 66.6,81.9
  Top 0.61: JP6.2 JP5.2 JP4.2 62,76.39
VFB
  Top 0.406: U1.7 36.41,62.49 R3.1 36.44,60.82 R5.1
VFB1
  Top 0.406: U2.7 53.41,62.49 R7.1 53.44,60.82 R9.1
VFB2
  Top 0.406: U3.7 70.41,62.49 R23.1 70.44,60.82 R25.1
VIN
  Top 0.406: U1.1 31.56,56.51 C1.1 31.25,56.52 R1.2 | R6.1 R1.2 | D1.C 30.36,55 R1.2
VIN1
  Top 0.406: U2.1 48.56,56.51 C4.1 48.25,56.52 R15.2 | R22.1 R15.2 | D4.C 47.36,55 R15.2
VIN2
  Top 0.406: U3.1 65.56,56.51 C11.1 65.25,56.52 R31.2 | R33.1 R31.2 | D7.C 64.36,55 R31.2
VIN_REG
  Top 0.406: U1.2 32.2,56.34 R1.1 34.25,55 R2.2
VIN_REG1
  Top 0.406: U2.2 49.2,56.34 R15.1 51.25,55 R21.2
VIN_REG2
  Top 0.406: U3.2 66.2,56.34 R31.1 68.25,55 R32.2
VS  (via drill 0.3)
  Top 0.406: R19.1 R20.1 30.7,48.7 30.7,47.4 33.5,47.4 | U$1.4 33.5,47.4 | U$2.4 50.5,47.4 | 50.5,47.4 47.7,47.4 47.7,48.7 R12.1 R13.1 42.55,47.3 v40.2,47.3 | U$3.4 67.5,47.5 | 67.5,47.5 64.7,47.5 64.7,48.7 R28.1 R29.1 59.55,47.3 v57.4,47.3 | IC1.5 78.55,63.6 C8.1 78.45,51.55 v74.4,47.5 | 67.5,47.5 68.3,47.5 v68.3,47.4 68.45,47.4 C15.1 | 50.5,47.4 51.45,47.4 C6.1 51.45,47.3 v51.4,47.3 | 33.5,47.4 34.3,47.4 v34.3,47.3 v34.45,47.3 C13.1
  Bottom 0.406: v74.4,47.5 68.4,47.5 v68.3,47.4 | v57.4,47.3 v51.4,47.3 | v40.2,47.3 v34.3,47.3